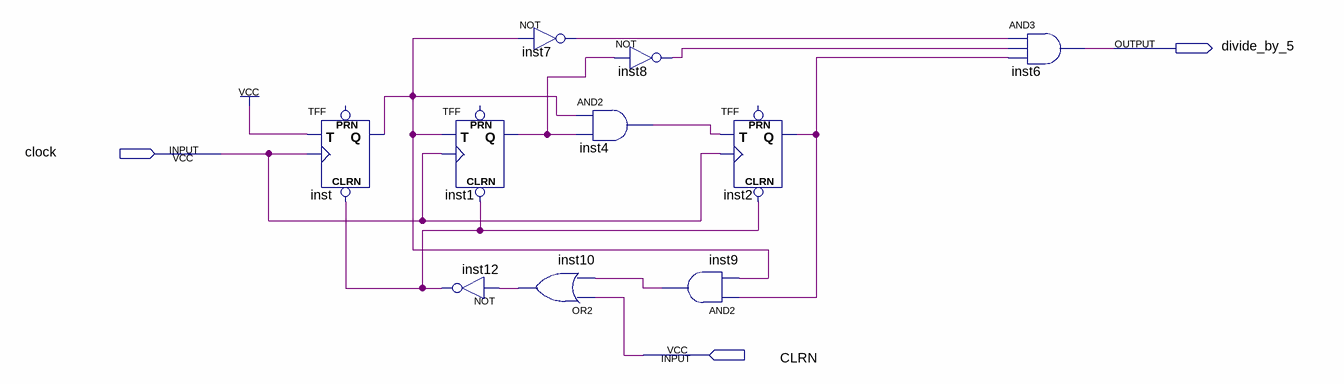
[diagram p0: schematic sheet]
// Quartus schematic divide_by_5.bdf as structural Verilog: 10 symbols, 3 pins
module divide_by_5 (
  input  clock,
  input  CLRN,
  output divide_by_5
);

  wire inst1_q, inst2_q, inst4_out, inst7_out, inst8_out, inst9_out, inst10_out, inst12_out, inst_q;

  TFF inst (.CLRN(inst12_out), .T(1'b1), .CLK(clock), .Q(inst_q));  // open: PRN
  TFF inst1 (.CLRN(inst12_out), .T(inst_q), .CLK(clock), .Q(inst1_q));  // open: PRN
  not inst12 (inst12_out, inst10_out);
  not inst7 (inst7_out, inst_q);
  or inst10 (inst10_out, CLRN, inst9_out);
  not inst8 (inst8_out, inst1_q);
  and inst4 (inst4_out, inst_q, inst1_q);
  and inst9 (inst9_out, inst2_q, inst_q);
  TFF inst2 (.CLRN(inst12_out), .T(inst4_out), .CLK(clock), .Q(inst2_q));  // open: PRN
  and inst6 (divide_by_5, inst7_out, inst8_out, inst2_q);
endmodule
